# EAGLE design Buck Boost (EAGLE 7.4.0)
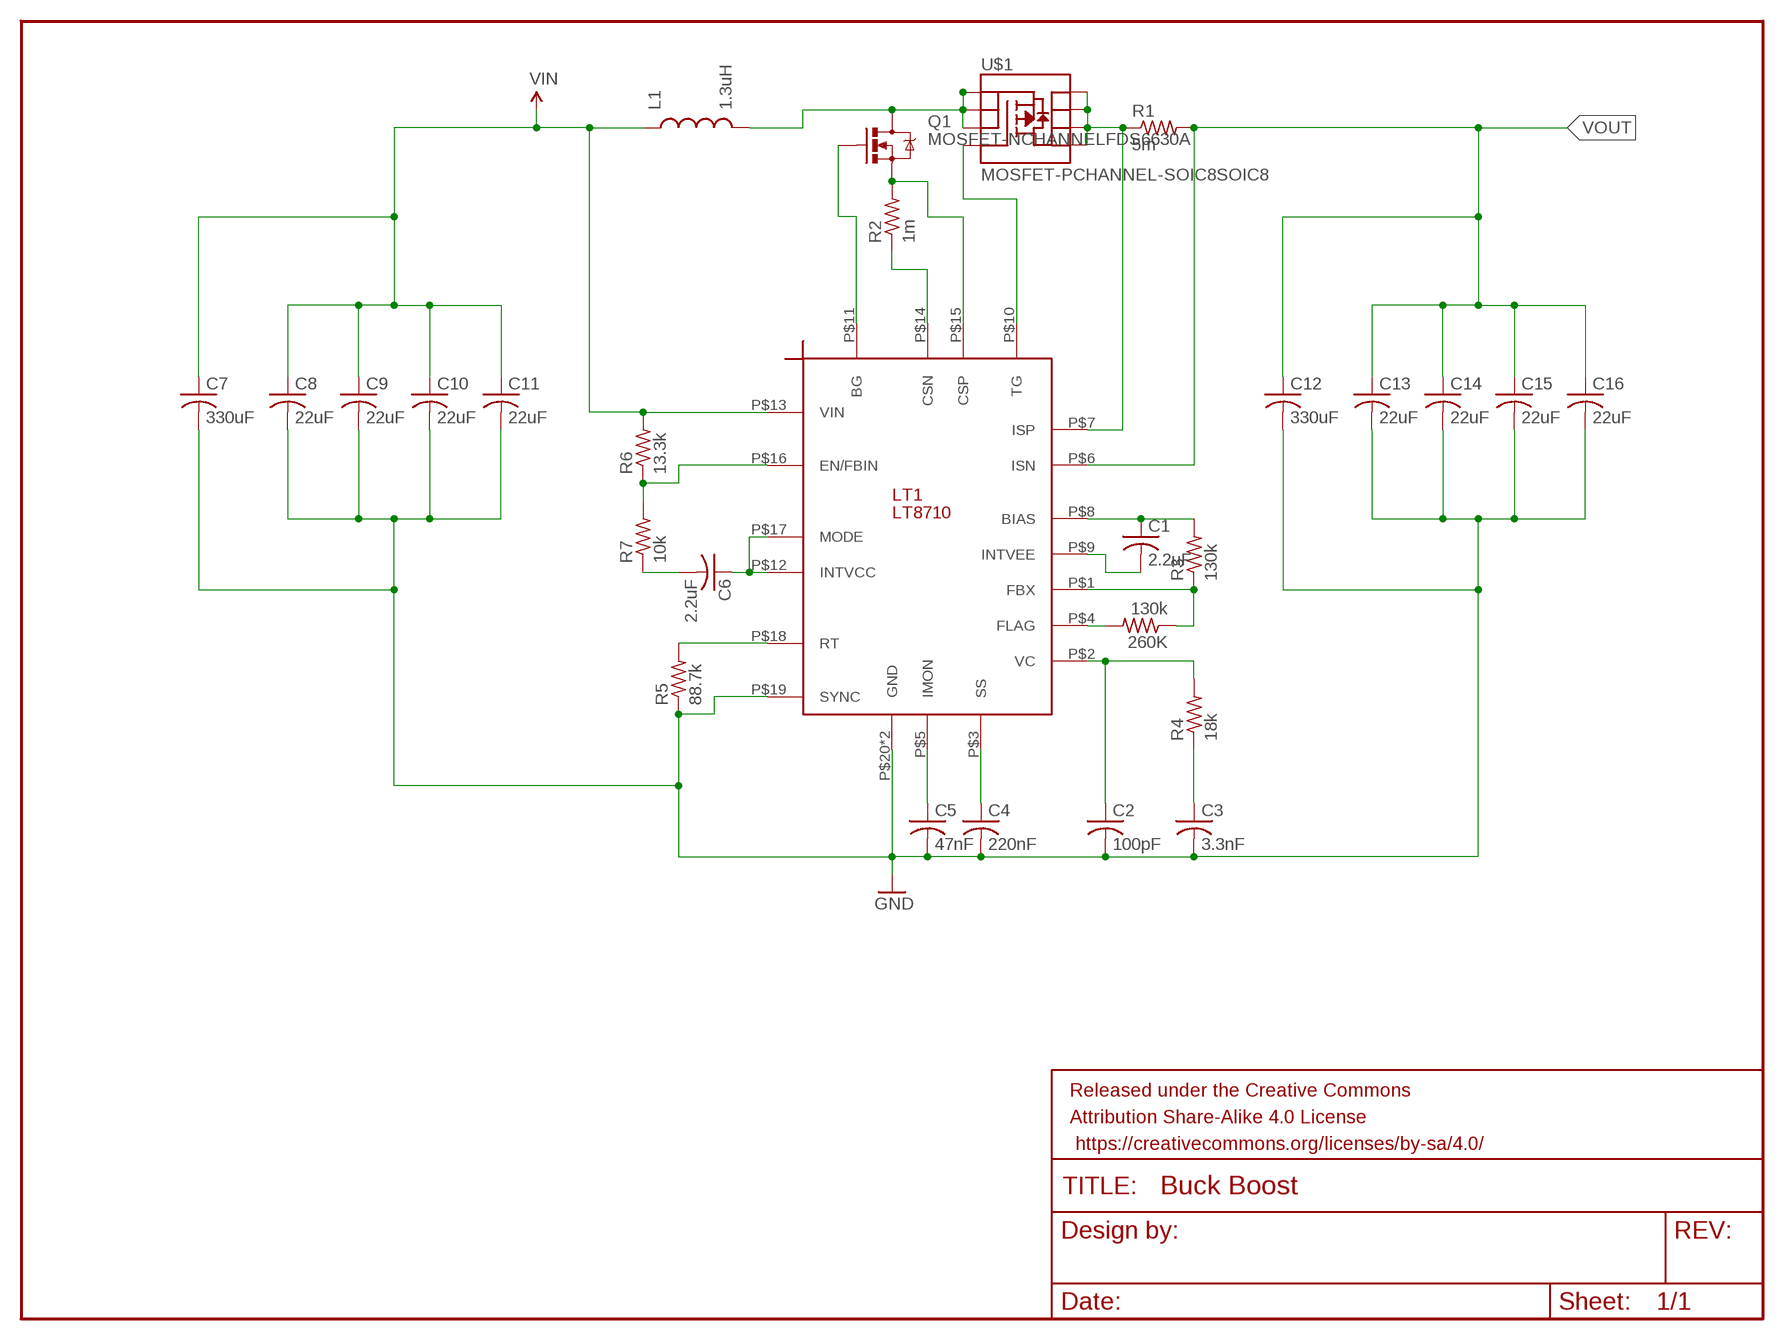
[diagram p0: schematic, sheet 1]

## Parts
260K  130k  R-US_R1206  [R1206]
C1  2.2uF  C-USC1206  [C1206]
C2  100pF  C-USC1206  [C1206]
C3  3.3nF  C-USC1206  [C1206]
C4  220nF  C-USC1206  [C1206]
C5  47nF  C-USC1206  [C1206]
C6  2.2uF  C-USC1206  [C1206]
C7  330uF  C-USC4564  [C4564]
C8  22uF  C-USC1206  [C1206]
C9  22uF  C-USC1206  [C1206]
C10  22uF  C-USC1206  [C1206]
C11  22uF  C-USC1206  [C1206]
C12  330uF  C-USC4564  [C4564]
C13  22uF  C-USC1206  [C1206]
C14  22uF  C-USC1206  [C1206]
C15  22uF  C-USC1206  [C1206]
C16  22uF  C-USC1206  [C1206]
FRAME1  FRAME-LETTERNO_PACKAGE  [DUMMY]
L1  1.3uH  INDUCTOR1210  [1210]
LT1  LT8710  [LT8710]
Q1  MOSFET-NCHANNELFDS6630A  [SO08]
R1  5m  R-US_R1206  [R1206]
R2  1m  R-US_R1206  [R1206]
R3  130k  R-US_R1206  [R1206]
R4  18k  R-US_R1206  [R1206]
R5  88.7k  R-US_R1206  [R1206]
R6  13.3k  R-US_R1206  [R1206]
R7  10k  R-US_R1206  [R1206]
U$1  MOSFET-PCHANNEL-SOIC8SOIC8  [SO08]

## Nets
GND: C2.2 C3.2 C4.2 C5.2 C7.2 C8.2 C9.2 C10.2 C11.2 C12.2 C13.2 C14.2 C15.2 C16.2 LT1.P$19(SYNC) LT1.P$20(GND) LT1.P$21(GND) R5.1
N$1: LT1.P$7(ISP) R1.1 U$1.5(D) U$1.6(D) U$1.7(D) U$1.8(D)
N$2: LT1.P$15(CSP) Q1.1(S) Q1.2(S) Q1.3(S) R2.2
N$3: C1.1 LT1.P$8(BIAS) R3.2
N$4: C1.2 LT1.P$9(INTVEE)
N$5: 260K.1 LT1.P$1(FBX) R3.1
N$6: 260K.2 LT1.P$4(FLAG)
N$7: LT1.P$16(EN/FBIN) R6.1 R7.2
N$8: C6.2 R7.1
N$9: C6.1 LT1.P$12(INTVCC) LT1.P$17(MODE)
N$10: C3.1 R4.1
N$11: LT1.P$18(RT) R5.2
N$12: C2.1 LT1.P$2(VC) R4.2
N$13: C4.1 LT1.P$3(SS)
N$14: C5.1 LT1.P$5(IMON)
N$16: LT1.P$14(CSN) R2.1
N$17: LT1.P$10(TG) U$1.4(G)
N$18: LT1.P$11(BG) Q1.4(G)
N$19: L1.2 Q1.5(D) Q1.6(D) Q1.7(D) Q1.8(D) U$1.1(S) U$1.2(S) U$1.3(S)
VIN: C7.1 C8.1 C9.1 C10.1 C11.1 L1.1 LT1.P$13(VIN) R6.2
VOUT: C12.1 C13.1 C14.1 C15.1 C16.1 LT1.P$6(ISN) R1.2

## Library data of the parts
260K R1-R7 = adafruit:R-US_: RESISTOR, American symbol
C1-C16 = adafruit:C-US: CAPACITOR, American symbol
FRAME1 = SparkFun-Aesthetics:FRAME-LETTER: Schematic Frame Standard 8.5x11 US Letter frame; DESIGNER: Nobody; VERSION: v01
L1 = SparkFun-Passives:INDUCTOR: Inductors Basic Inductor/Choke - 0603 and 1206. Footprints are not proven and vary greatly between part numbers. INDUCTOR POWER 3.3UH 4.0A SMD 0.197" L x 0.197" W x 0.177" H (5.00mm x 5.00mm x 4.50mm)
LT1 = lt8710:LT8710
Q1 = SparkFun-DiscreteSemi:MOSFET-NCHANNEL: Common NMOSFET Parts MFG P/N Store ID Prod ID FDD8780 TRANS-09984 SI7820DN TRANS-11055 FDS6630A IC-08089 2N7002PW TRANS-11151 FQP30N06L COM-10213 TRANS-10060 BSS123LT1G TRANS-08345 BSS138 TRANS-00830 BS170 2N7000; PROD_ID: IC-08089
U$1 = SparkFun-DiscreteSemi:MOSFET-PCHANNEL-SOIC8: Generic 8-pin PMOSFET

## Board
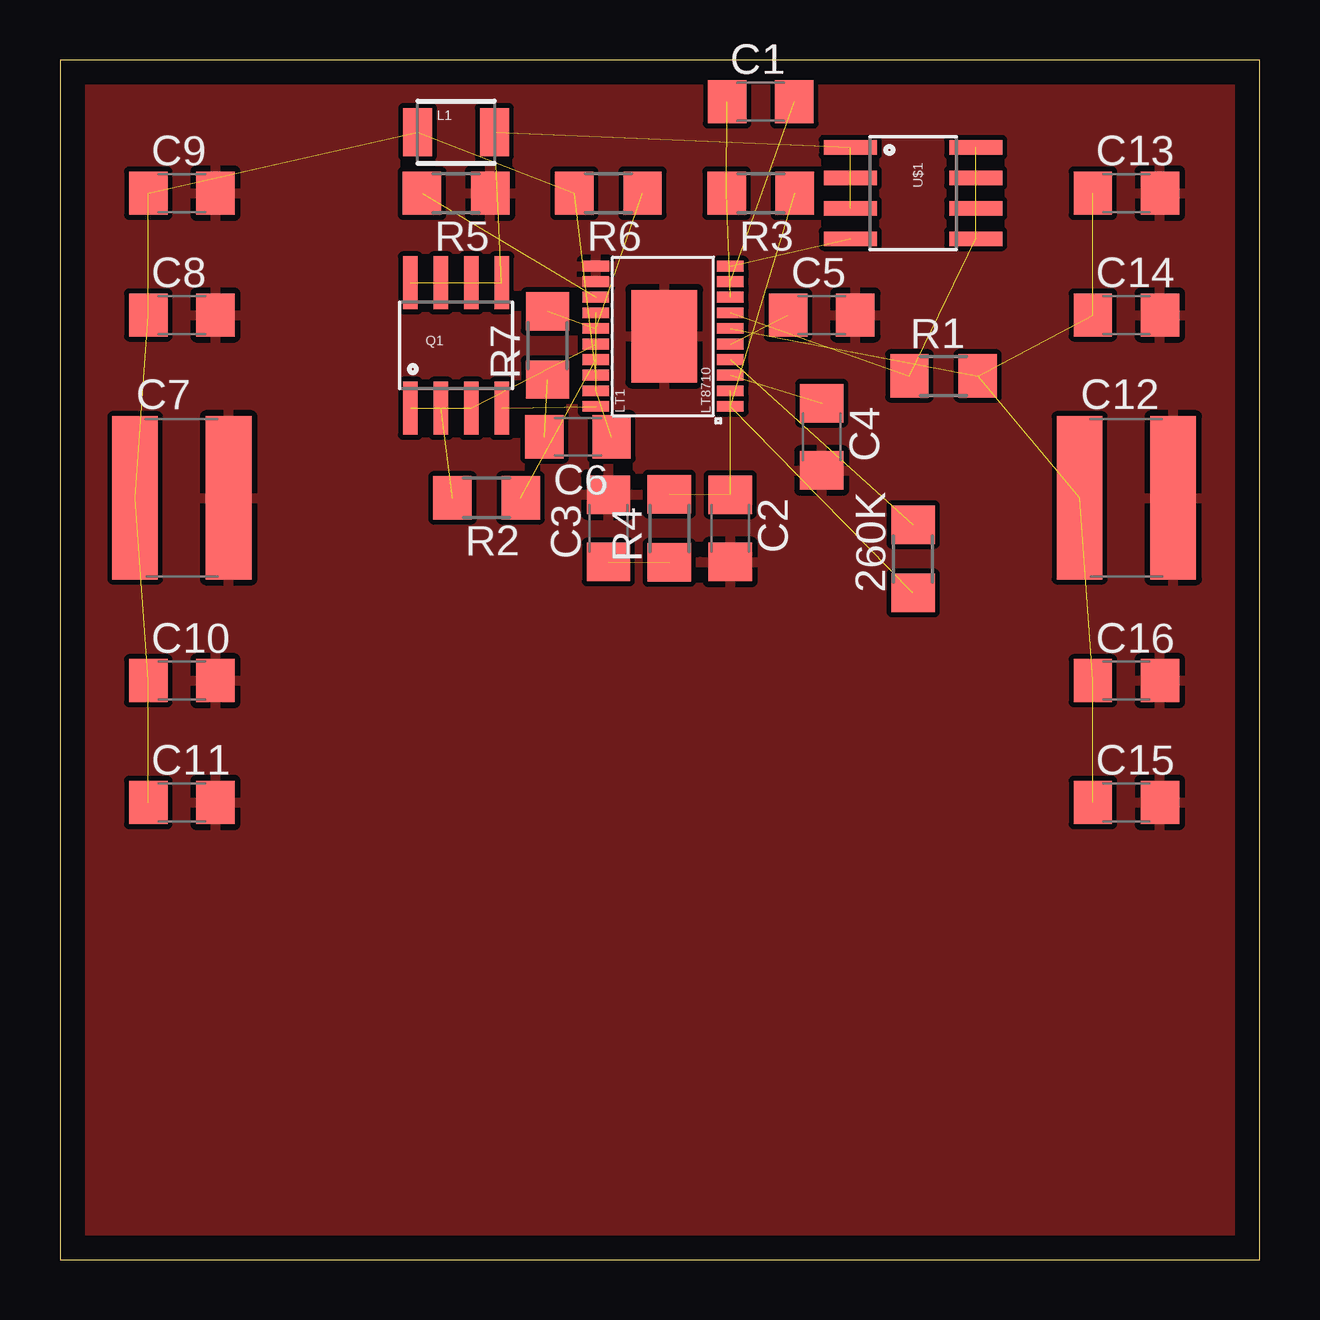
[diagram p1: board, top side]
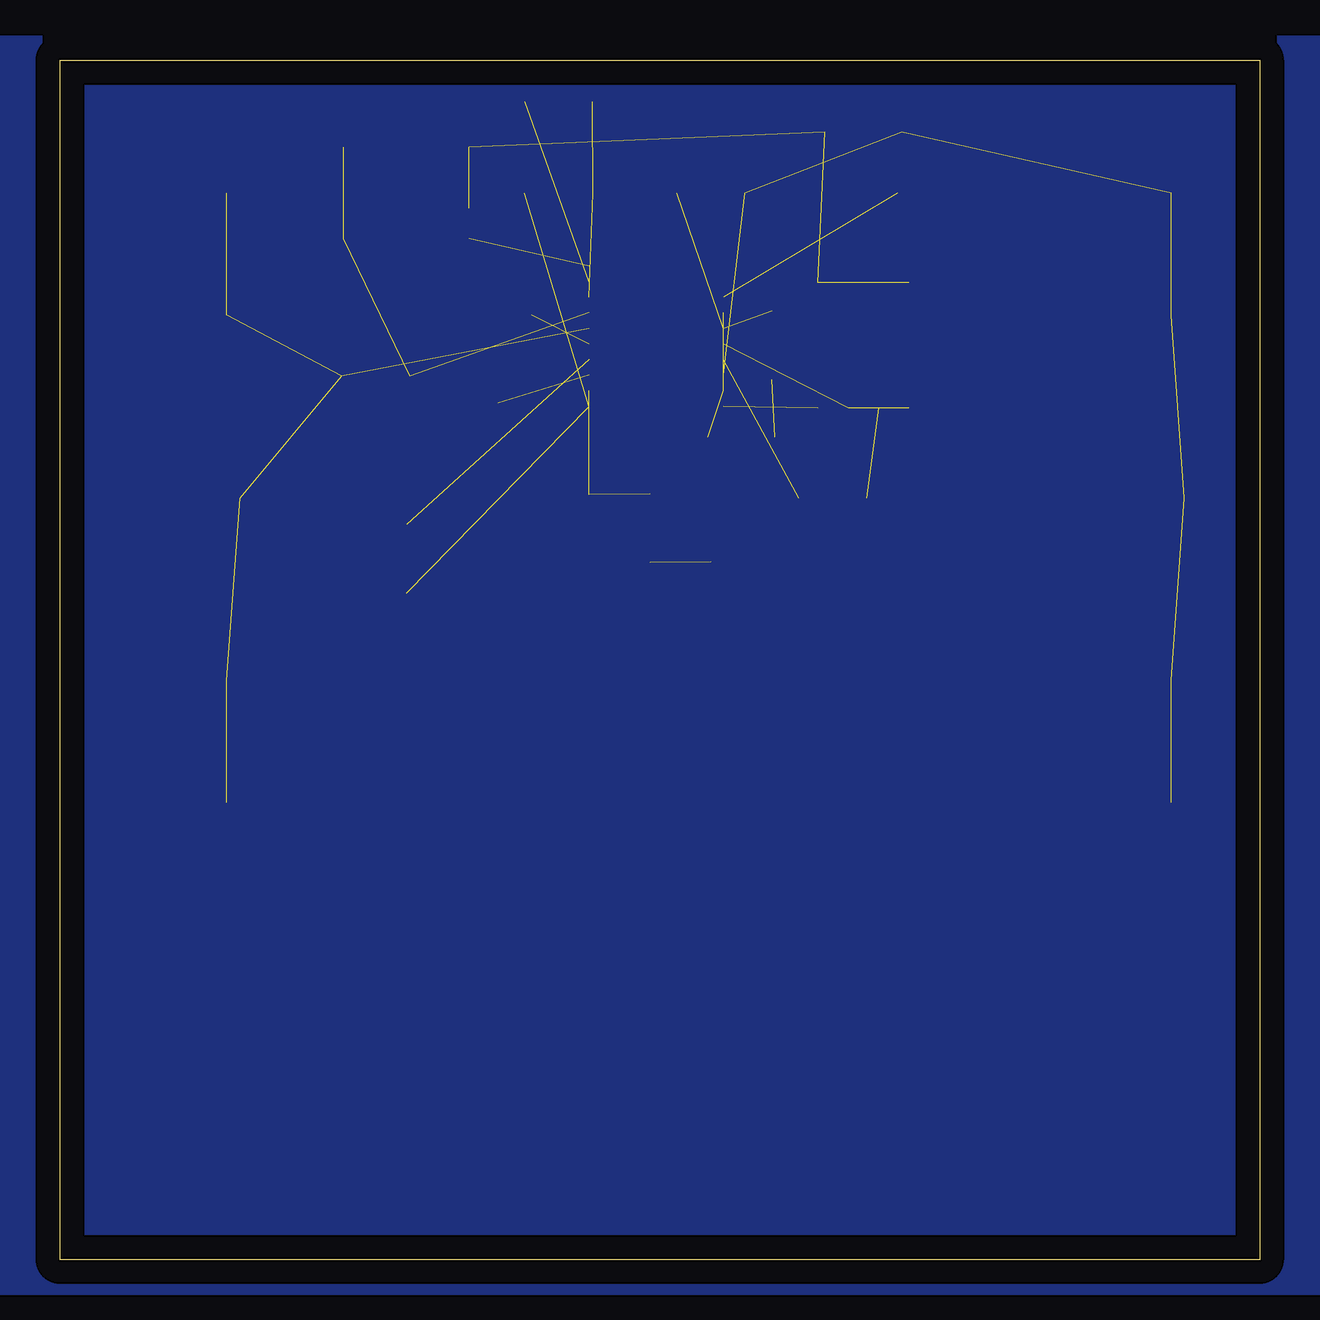
[diagram p2: board, bottom side, seen from below]

Size 50 x 50 mm. Coordinates in mm from the lower left corner, seen from the top.
Outline: 0,0 50,0 50,50 0,50 0,0
Copper layers (1*16): Top 0.035mm / dielectric 1.5mm / Bottom 0.035mm
Design rules "default": minimum track width 10mil, minimum drill 24mil, track to track 8mil, track to pad 8mil, pad to pad 8mil, via to via 8mil, smd to smd 8mil, copper to edge 40mil, drill to drill 8mil, minimum pad ring 10mil, minimum via ring 8mil, stop-mask expansion 4mil, vias tented up to drill 0mil, thermal gap 10mil

### Footprints (pad centres in the part's own frame; a part is rotated, then mirrored left to right if it is on the bottom)
R1206 = smd 1.6 x 1.803: 1 -1.422,0; 2 1.422,0
C1206 = smd 1.6 x 1.8: 1 -1.4,0; 2 1.4,0
C4564 = smd 1.9 x 6.8: 1 -1.95,0; 2 1.95,0
1210 = smd 1.2 x 2: 1 -1.6,0; 2 1.6,0
LT8710 = smd 0.45 x 1.1: P$1 0,0; P$2 0.65,0; P$3 1.3,0; P$4 1.95,0; P$5 2.6,0; P$6 3.25,0; P$7 3.9,0; P$8 4.55,0; P$9 5.2,0; P$10 5.85,0; P$11 0,5.6; P$12 0.65,5.6; P$13 1.3,5.6; P$14 1.95,5.6; P$15 2.6,5.6; P$16 3.25,5.6; P$17 3.9,5.6; P$18 4.55,5.6; P$19 5.2,5.6; P$20 5.85,5.6 | smd 3.86 x 2.74: P$21 2.925,2.75
SO08 = smd 0.61 x 2.21: 1 -1.905,-2.616; 2 -0.635,-2.616; 3 0.635,-2.616; 4 1.905,-2.616; 5 1.905,2.616; 6 0.635,2.616; 7 -0.635,2.616; 8 -1.905,2.616

### Placement (x,y rotation side)
260K  35.56,29.21 90 top
C1  29.21,48.26 0 top
C2  27.94,30.48 270 top
C3  22.86,30.48 90 top
C4  31.75,34.29 270 top
C5  31.75,39.37 0 top
C6  21.59,34.29 180 top
C7  5.08,31.75 0 top
C8  5.08,39.37 0 top
C9  5.08,44.45 0 top
C10  5.08,24.13 0 top
C11  5.08,19.05 0 top
C12  44.45,31.75 0 top
C13  44.45,44.45 0 top
C14  44.45,39.37 0 top
C15  44.45,19.05 0 top
C16  44.45,24.13 0 top
FRAME1  0,0 0 top
L1  16.51,46.99 0 top
LT1  27.94,35.56 90 top
Q1  16.51,38.1 0 top
R1  36.83,36.83 0 top
R2  17.78,31.75 180 top
R3  29.21,44.45 180 top
R4  25.4,30.48 90 top
R5  16.51,44.45 180 top
R6  22.86,44.45 180 top
R7  20.32,38.1 90 top
U$1  35.56,44.45 270 top

### Tracks (layer width: path | path; a pad name or v marks a point on that pad's centre or on a via)
GND
  pour Bottom: -2.54,50.8 55.88,50.8 55.88,-1.27 -2.54,-1.27
  pour Top: -2.54,50.8 55.88,50.8 55.88,-1.27 -2.54,-1.27
N$1  (5 unrouted)
N$2  (4 unrouted)
N$3  (2 unrouted)
N$4  (1 unrouted)
N$5  (2 unrouted)
N$6  (1 unrouted)
N$7  (2 unrouted)
N$8  (1 unrouted)
N$9  (2 unrouted)
N$10  (1 unrouted)
N$11  (1 unrouted)
N$12  (2 unrouted)
N$13  (1 unrouted)
N$14  (1 unrouted)
N$16  (1 unrouted)
N$17  (1 unrouted)
N$18  (1 unrouted)
N$19  (7 unrouted)
VIN  (7 unrouted)
VOUT  (6 unrouted)